# EAGLE design Music (EAGLE 5.04)
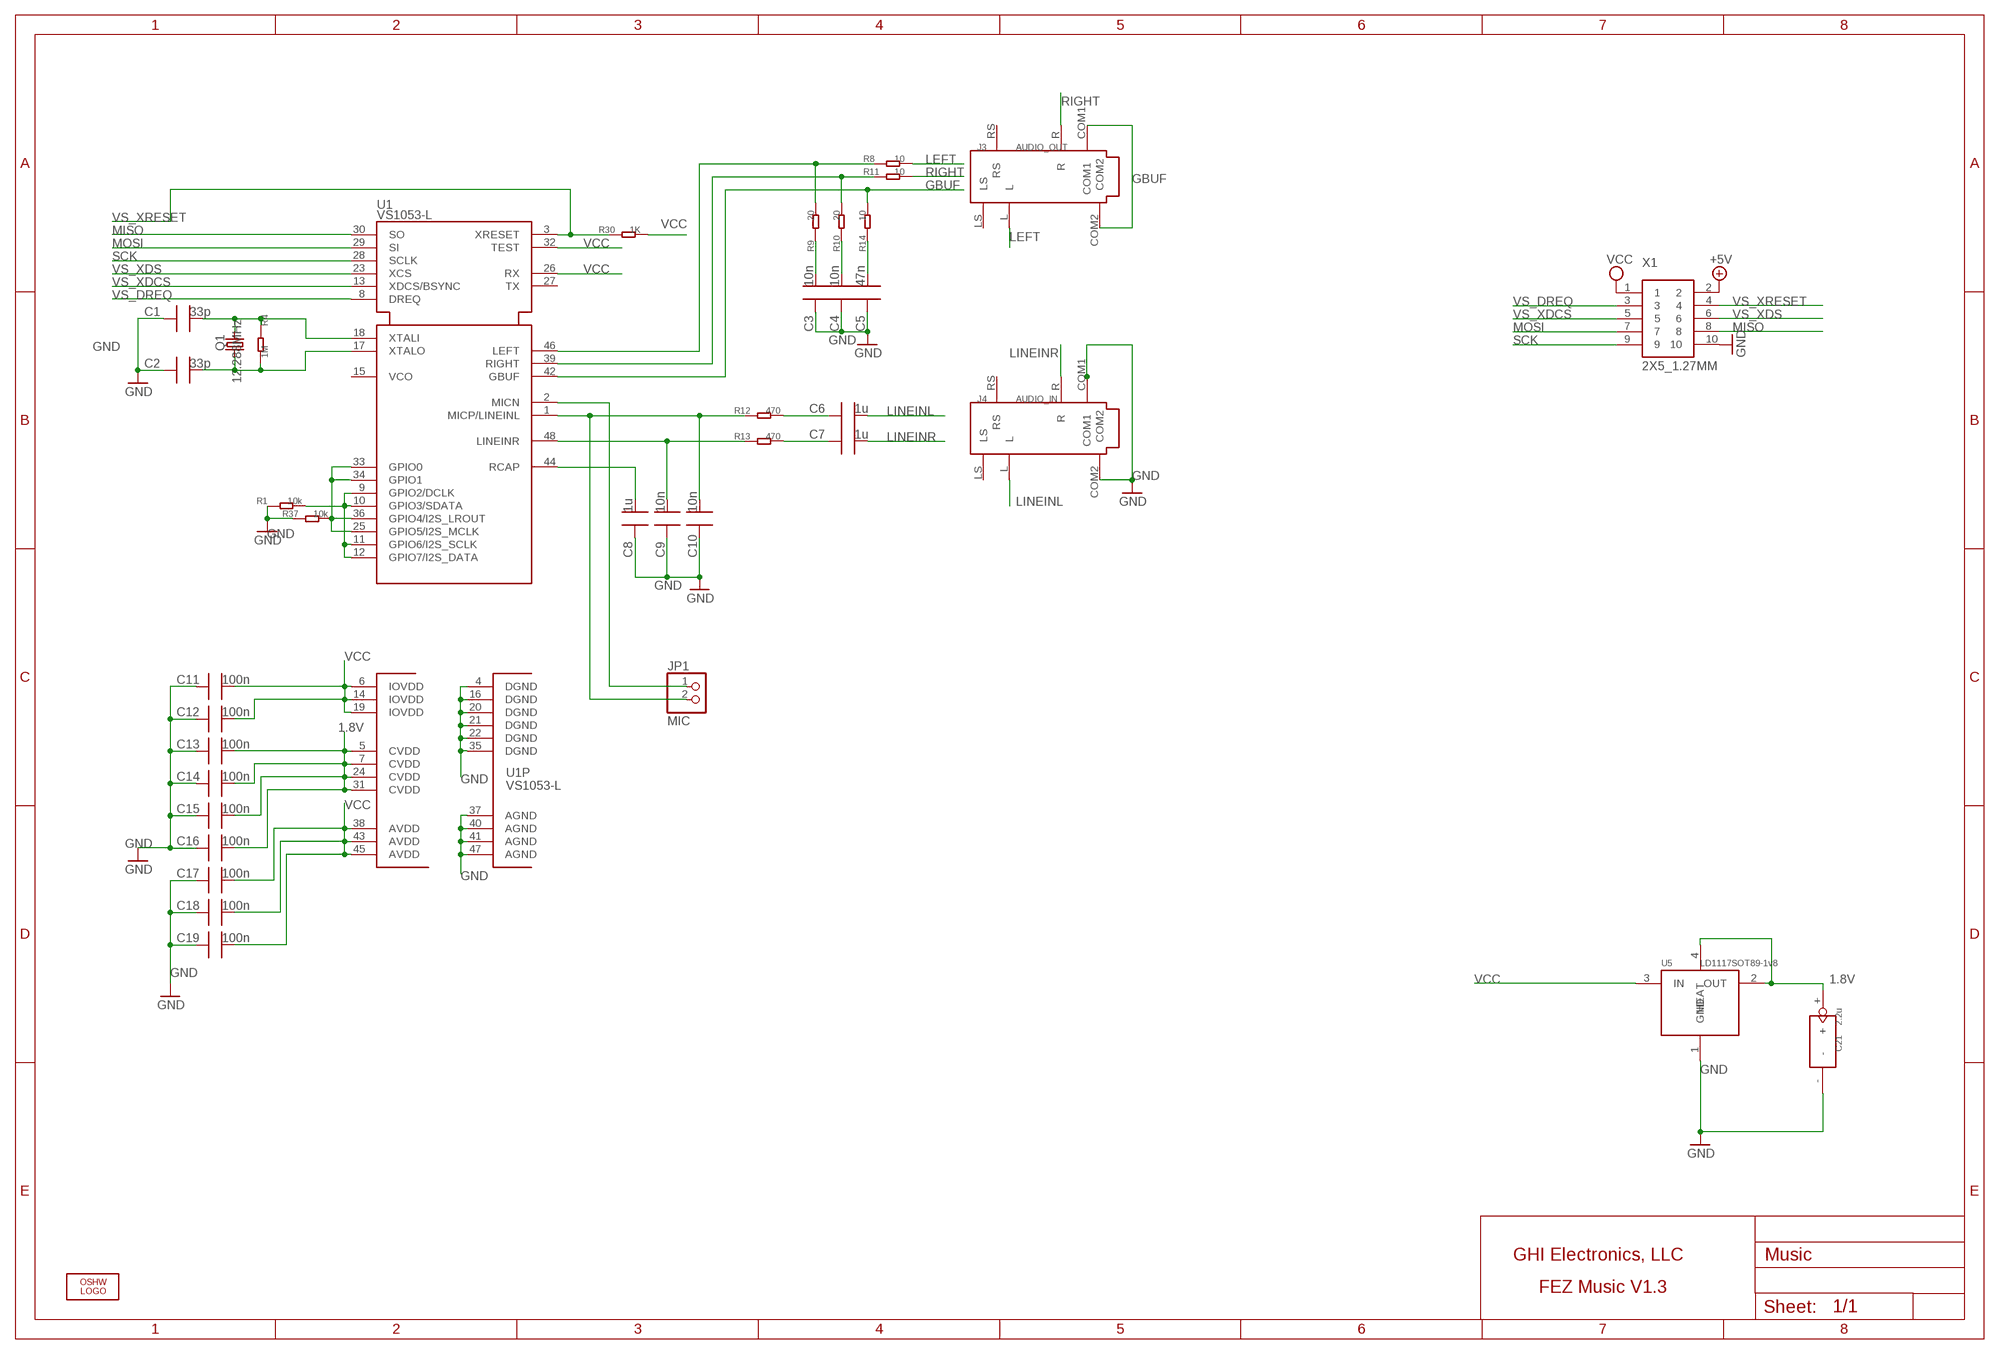
[diagram p0: schematic, sheet 1]

## Parts
C1  33p  C0603  [0603]
C2  33p  C0603  [0603]
C3  10n  C0603  [0603]
C4  10n  C0603  [0603]
C5  47n  C0603  [0603]
C6  1u  C0603  [0603]
C7  1u  C0603  [0603]
C8  1u  C0603  [0603]
C9  10n  C0603  [0603]
C10  10n  C0603  [0603]
C11  100n  C0603  [0603]
C12  100n  C0603  [0603]
C13  100n  C0603  [0603]
C14  100n  C0603  [0603]
C15  100n  C0603  [0603]
C16  100n  C0603  [0603]
C17  100n  C0603  [0603]
C18  100n  C0603  [0603]
C19  100n  C0603  [0603]
C21  2.2u  C_TAN_3X3.5  [C_TAN_3X3.5]
J3  AUDIO_OUT  AUDIO  [3.5MM_AUDIO]
J4  AUDIO_IN  AUDIO  [3.5MM_AUDIO]
JP1  MIC  PINHD-1X2  [1X02]
LOGO2  LOGO-OSHW-FILLX0200-NT  [OSHW_FILLX200_NOTEXT]
Q1  12.288MHz  CRYSTALHC49UP  [HC49UP]
R1  10k  R0603  [0603]
R4  1M  R0603  [0603]
R8  10  R0603  [0603]
R9  20  R0603  [0603]
R10  20  R0603  [0603]
R11  10  R0603  [0603]
R12  470  R0603  [0603]
R13  470  R0603  [0603]
R14  10  R0603  [0603]
R30  1K  R0603  [0603]
R37  10k  R0603  [0603]
U1  VS1053-L  [LQFP48]
U5  LD1117SOT89-1v8  LD1117SOT89  [SOT89]
X1  2X5_1.27MM  [2X5_1.27MM]

## Nets
1.8V: C13.2 C14.2 C15.2 C16.2 C21.+ U1.5(CVDD) U1.7(CVDD) U1.24(CVDD) U1.31(CVDD) U5.2(OUT) U5.4(HEAT)
+5V: X1.2
GBUF: J3.COM1 J3.COM2 R14.2 U1.42(GBUF)
GND: C1.1 C2.1 C3.1 C4.1 C5.1 C8.1 C9.1 C10.1 C11.1 C12.1 C13.1 C14.1 C15.1 C16.1 C17.1 C18.1 C19.1 C21.- J4.COM1 J4.COM2 R1.1 R37.1 U1.4(DGND) U1.16(DGND) U1.20(DGND) U1.21(DGND) U1.22(DGND) U1.35(DGND) U1.37(AGND) U1.40(AGND) U1.41(AGND) U1.47(AGND) U5.1(GND) X1.10
LEFT: J3.L R8.2
LINEINL: C6.2 J4.L
LINEINR: C7.2 J4.R
MISO: U1.30(SO) X1.8
MOSI: U1.29(SI) X1.7
N$1: C1.2 Q1.2 R4.1 U1.18(XTALI)
N$2: C2.2 Q1.1 R4.2 U1.17(XTALO)
N$5: R8.1 R9.2 U1.46(LEFT)
N$6: R10.2 R11.1 U1.39(RIGHT)
N$7: C10.2 JP1.2 R12.1 U1.1(MICP/LINEINL)
N$8: C3.2 R9.1
N$9: C4.2 R10.1
N$10: C5.2 R14.1
N$11: C9.2 R13.1 U1.48(LINEINR)
N$12: C8.2 U1.44(RCAP)
N$14: C6.1 R12.2
N$15: C7.1 R13.2
N$21: R37.2 U1.25(GPIO5/I2S_MCLK) U1.33(GPIO0) U1.34(GPIO1) U1.36(GPIO4/I2S_LROUT)
N$24: R1.2 U1.9(GPIO2/DCLK) U1.10(GPIO3/SDATA) U1.11(GPIO6/I2S_SCLK) U1.12(GPIO7/I2S_DATA)
N$25: JP1.1 U1.2(MICN)
RIGHT: J3.R R11.2
SCK: U1.28(SCLK) X1.9
VCC [power]: C11.2 C12.2 C17.2 C18.2 C19.2 R30.2 U1.6(IOVDD) U1.14(IOVDD) U1.19(IOVDD) U1.26(RX) U1.32(TEST) U1.38(AVDD) U1.43(AVDD) U1.45(AVDD) U5.3(IN) X1.1
VS_DREQ: U1.8(DREQ) X1.3
VS_XDCS: U1.13(XDCS/BSYNC) X1.5
VS_XDS: U1.23(XCS) X1.6
VS_XRESET: R30.1 U1.3(XRESET) X1.4
Unconnected: J3.LS J3.RS J4.LS J4.RS U1.15(VCO) U1.27(TX)

## Notes on the sheet
- GHI Electronics, LLC
- FEZ Music V1.3

## Library data of the parts
C1-C19 = CPT_SMD:C0603; C0603: 100N
C21 = CPT_SMD:C_TAN
J3 J4 = MusicShield:AUDIO
JP1 = pinhead:PINHD-1X2: PIN HEADER
LOGO2 = Logo:LOGO-OSHW-FILL
Q1 = crystal:CRYSTAL: CRYSTAL
R1 R4 R8-R14 R30 R37 = CPT_SMD:R0603
U1 = vlsi:VS1053
U5 = ICs_v54:LD1117
X1 = GHI:2X5_1.27MM

## Net classes
0 default: width 0.152 mm, drill 0.305 mm, clearance 0.152 mm

## Board
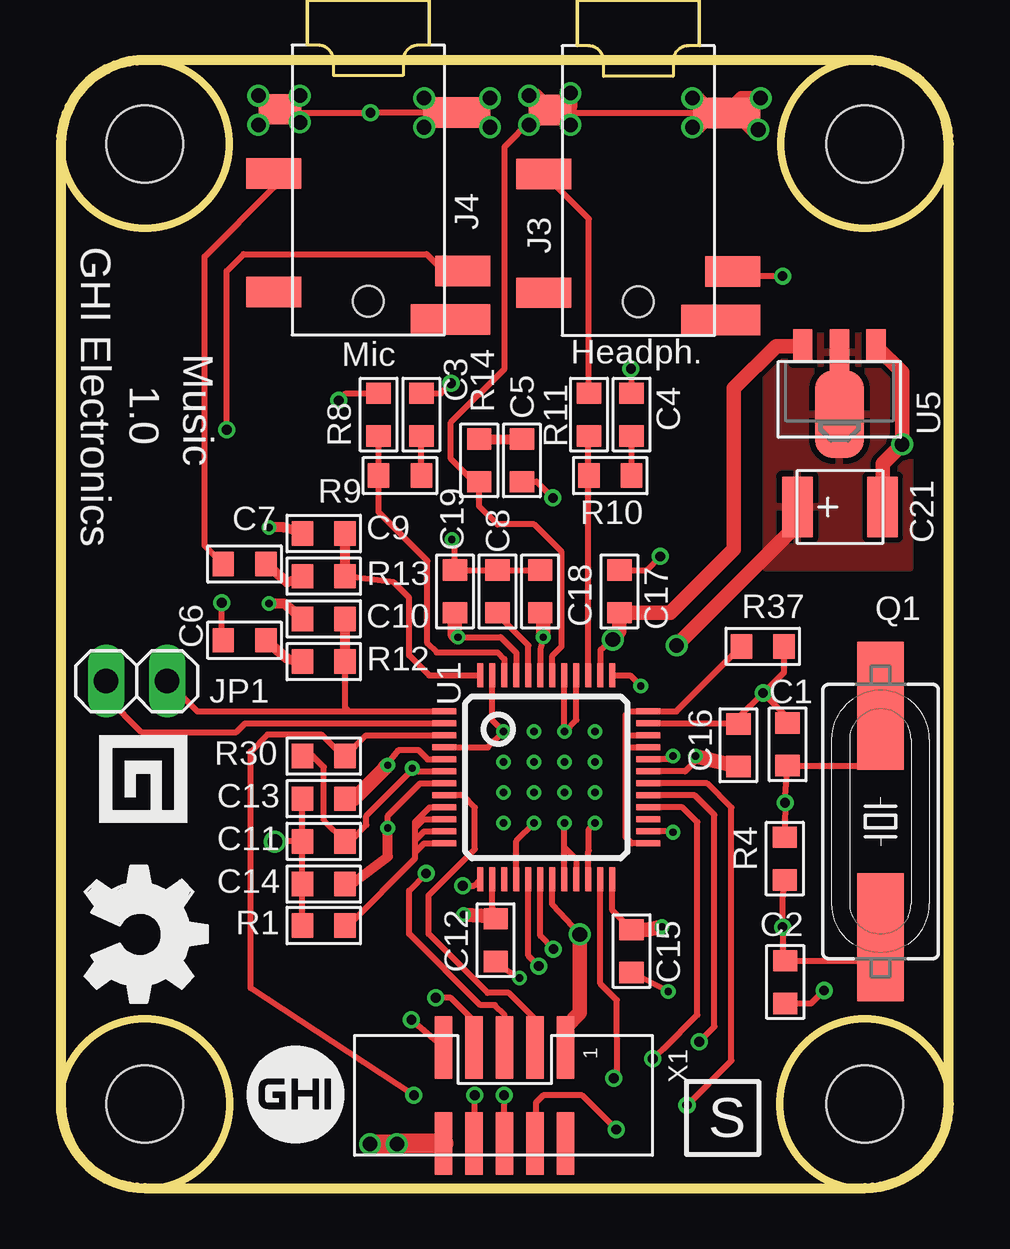
[diagram p1: board, top side]
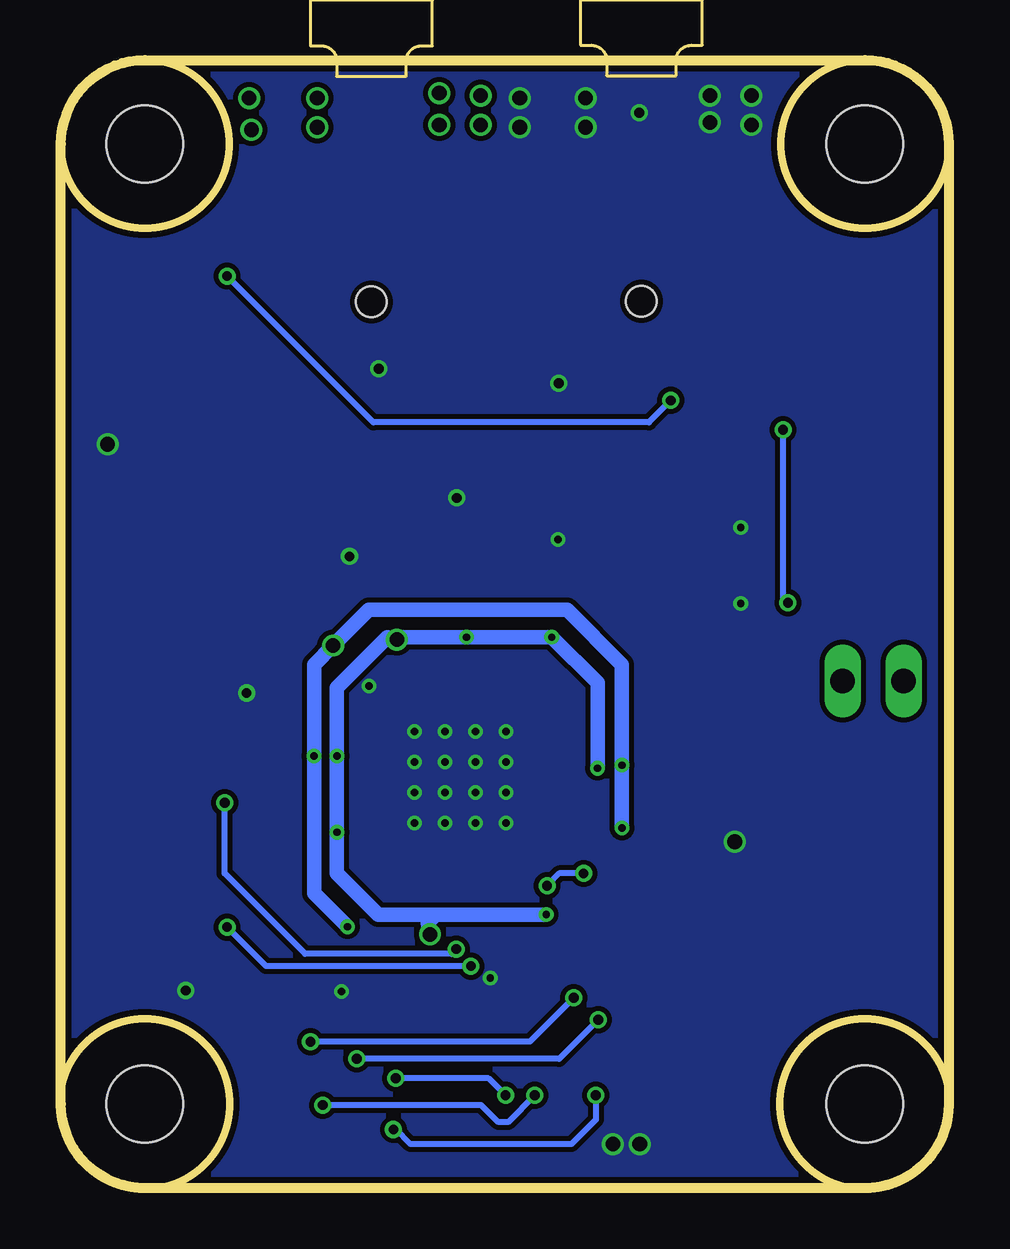
[diagram p2: board, bottom side, seen from below]

Size 37.07 x 47.04 mm. Coordinates in mm from the lower left corner, seen from the top.
Outline: 33.54,0.04 arc90 37.04,3.54 37.04,43.54 arc90 33.54,47.04 3.54,47.04 arc90 0.04,43.54 0.04,3.54 arc90 3.54,0.04 33.54,0.04
Outline: circle at 3.54,43.54 radius 3.5
Outline: circle at 33.54,43.54 radius 3.5
Outline: circle at 33.54,3.54 radius 3.54
Outline: circle at 3.54,3.54 radius 3.54
Copper layers (1+16): Top 0.035mm / dielectric 1.5mm / Bottom 0.035mm
Design rules "SeeedStudio_rule_no_angle_090911 *": minimum track width 6mil, minimum drill 12mil, track to track 8mil, track to pad 8mil, pad to pad 8mil, via to via 8mil, smd to smd 8mil, copper to edge 10mil, drill to drill 10mil, minimum pad ring 10mil, minimum via ring 6mil, stop-mask expansion 2mil, vias tented up to drill 100mil, thermal gap 10mil
Holes 3.2 mm at 3.54,3.54 33.54,43.54 3.54,43.54 33.54,3.54

### Footprints (pad centres in the part's own frame; a part is rotated, then mirrored left to right if it is on the bottom)
0603 = smd 0.889 x 1.016: 1 -0.889,0; 2 0.889,0
C_TAN_3X3.5 = smd 2.54 x 1.27: + 0,1.778; - 0,-1.778
3.5MM_AUDIO = smd 1.27 x 1.778: COM1 -4.572,3.683 | smd 1.27 x 2.794: COM2 -4.699,-3.683 | smd 1.27 x 2.286: L -11.303,-3.937; R -7.239,3.937; RS -12.192,3.937 | smd 1.27 x 3.302: LS -13.335,-3.429 | hole 1.27: -12.573,0
1X02 = drill 1.016 long: 1 -1.27,0; 2 1.27,0
HC49UP = smd 5.334 x 1.93: 1 -4.826,0; 2 4.826,0
LQFP48 = smd 0.25 x 1: 1 -2.75,-4.25; 2 -2.25,-4.25; 3 -1.75,-4.25; 4 -1.25,-4.25; 5 -0.75,-4.25; 6 -0.25,-4.25; 7 0.25,-4.25; 8 0.75,-4.25; 9 1.25,-4.25; 10 1.75,-4.25; 11 2.25,-4.25; 12 2.75,-4.25; 25 2.75,4.25; 26 2.25,4.25; 27 1.75,4.25; 28 1.25,4.25; 29 0.75,4.25; 30 0.25,4.25; 31 -0.25,4.25; 32 -0.75,4.25; 33 -1.25,4.25; 34 -1.75,4.25; 35 -2.25,4.25; 36 -2.75,4.25 | smd 1 x 0.25: 13 4.25,-2.75; 14 4.25,-2.25; 15 4.25,-1.75; 16 4.25,-1.25; 17 4.25,-0.75; 18 4.25,-0.25; 19 4.25,0.25; 20 4.25,0.75; 21 4.25,1.25; 22 4.25,1.75; 23 4.25,2.25; 24 4.25,2.75; 37 -4.25,2.75; 38 -4.25,2.25; 39 -4.25,1.75; 40 -4.25,1.25; 41 -4.25,0.75; 42 -4.25,0.25; 43 -4.25,-0.25; 44 -4.25,-0.75; 45 -4.25,-1.25; 46 -4.25,-1.75; 47 -4.25,-2.25; 48 -4.25,-2.75
SOT89 = smd 0.8 x 1.4: 1 -1.524,-1.905; 3 1.524,-1.905 | smd 0.8 x 1.9: 2 0,-1.651 | smd 2.032 x 3.65: 4 0,0.94
2X5_1.27MM = smd 2.6 x 0.74: 1 -2,2.58; 2 2,2.58; 3 -2,1.31; 4 2,1.31; 5 -2,0.04; 6 2,0.04; 7 -2,-1.23; 8 2,-1.23; 9 -2,-2.5; 10 2,-2.5

### Placement (x,y rotation side)
C1  30.32,18.52 270 top
C2  30.22,8.62 90 top
C3  15.06,32.26 270 top
C4  23.82,32.26 270 top
C5  19.25,30.35 90 top
C6  7.69,22.86 180 top
C7  7.69,26.03 180 top
C8  18.23,24.89 270 top
C9  10.99,27.3 0 top
C10  10.99,23.75 0 top
C11  10.99,14.48 0 top
C12  18.15,10.36 90 top
C13  10.99,16.26 0 top
C14  10.99,12.7 0 top
C15  23.82,9.91 90 top
C16  28.27,18.48 270 top
C17  23.31,24.89 270 top
C18  20.01,24.89 270 top
C19  16.45,24.89 270 top
C21  32.5,28.41 90 top
J3  24.1,49.53 90 top
J4  12.85,49.56 90 top
JP1  3.19,21.16 0 top
LOGO2  1.05,13.45 270 top
Q1  34.19,15.31 90 top
R1  10.99,10.97 0 top
R4  30.2,13.76 270 top
R8  13.28,32.26 90 top
R9  14.17,29.72 180 top
R10  22.93,29.72 180 top
R11  22.04,32.26 90 top
R12  10.99,21.97 180 top
R13  10.99,25.53 180 top
R14  17.47,30.35 270 top
R30  10.99,18.03 180 top
R37  29.28,22.61 180 top
U1  20.26,17.14 270 top
U5  32.48,33.21 180 top
X1  18.48,3.9 270 top

### Tracks (layer width: path | path; a pad name or v marks a point on that pad's centre or on a via)
1.8V  (via drill 0.3, 0.61)
  Top 0.254: v26.48,18.03 26.49,17.83 26.05,17.39 U1.31 | U1.5 15.32,17.89 14.93,18.29 14.12,18.29 13.53,17.58 | U1.7 15.94,16.89 15.06,16.89 15,16.89 13.66,15.54 v13.66,15.04 13.66,14.99 | U1.24 23.01,11.6 C15.2
  Top 0.406: 13.66,14.99 13.66,13.84 12.13,12.7 C14.2
  Top 0.61: C15.2 24.45,10.79 v25.09,10.92 | C16.2 v26.49,18.03 v26.48,18.03 | C13.2 12.26,16.26 v13.66,17.65 13.61,17.65 13.53,17.58 | C21.+ 30.72,27.67 v25.69,22.64
  Bottom 0.61: v25.09,10.92 26.49,12.32 v26.49,18.03 26.49,21.84 v25.69,22.64 24.2,24.13 15.94,24.13 13.66,21.84 v13.66,17.65 v13.66,15.04
  pour Top: 35.4,25.87 29.43,25.87 29.43,35.52 35.4,35.52
GBUF  (via drill 0.61)
  Top 0.254: U1.42 20.51,22.22 20.9,22.61 20.9,26.54 19.75,27.69 18.23,27.69 17.47,28.45 R14.2 17.24,29.46 16.29,30.41 16.29,31.94 18.53,34.17 18.53,43.42 19.64,44.54 20.4,44.94 J3.COM1 20.54,44.83 20.97,44.83 21.27,44.83 27.16,44.83 J3.COM2
  Top 0.61: v19.54,45.55 19.82,45.55 J3.COM1 | v21.27,45.65 21.27,45.14 20.97,44.83 20.47,44.83 20.36,44.94 20.15,44.94 v19.54,44.33 | 21.27,44.83 v21.27,44.33 | v26.35,45.45 26.54,45.45 27.16,44.83 26.56,44.23 v26.35,44.23 | v29.19,45.45 28.4,45.45 J3.COM2 27.97,44.64 28.38,44.64 28.89,44.13 v29.09,44.13
GND  (via drill 0.3, 0.41, 0.61)
  Top 0.254: U1.47 18.01,19.52 v18.48,19.05 17.83,18.39 U1.4 | 21.01,14.22 21.01,15.23 v21.02,15.24 | U1.20 21.01,14.22 | U1.21 21.51,13.72 21.01,14.22 | U1.22 22.01,14.07 22.04,14.1 22.04,14.99 v22.29,15.24 | U1.16 19.01,14.5 v19.75,15.24 | U1.41 21.01,19.06 v21.02,19.05 21.51,19.54 U1.40 | R1.1 C14.1 C11.1 | C12.1 18.36,9.27 v19.15,8.79 | C15.1 v25.34,8.23 | C11.1 8.97,14.48 v8.95,14.46 | C11.1 C13.1 | v16.33,27.05 16.45,26.92 C19.1 C8.1 C18.1 | C17.1 24.44,25.78 v25.01,26.35 | C5.1 19.86,29.46 v20.54,28.79 | C4.1 23.82,34.14 v23.79,34.17 | C2.1 31.3,7.73 v31.84,8.27 | U1.37 23.76,21.39 v24.2,20.95 | U1.35 28.24,19.39 C16.1 28.27,19.63 v29.3,20.66 | R37.1 30.17,21.53 v29.3,20.66 | C1.1 30.32,19.64 v29.3,20.66 | C3.1 15.87,33.15 v16.29,33.56 | J4.COM2 12.95,44.86 v12.94,44.84 9.31,44.84 J4.COM1
  Top 0.406: v8.71,27.56 9.34,27.56 C9.1 | v8.71,24.38 9.34,24.38 C10.1
  Top 0.61: C21.- 34.28,30.21 v35.09,31.02 35.09,34.03 U5.1
  Top 0.813: X1.10 14.07,1.9 v14.03,1.86 v12.92,1.86
  other vias: 22.29,19.05 22.29,17.78 22.29,16.51 18.48,15.24 18.48,16.51 18.48,17.78 19.75,19.05 21.02,17.78 21.02,16.51 19.75,16.51 19.75,17.78 8.27,45.55 8.27,44.33 9.99,44.43 9.99,45.55 15.17,45.45 15.17,44.23 17.92,44.23 17.92,45.45
  pour Bottom: 0.34,-0.07 33.7,-0.07 arc90 37.2,3.43 37.2,46.97 3.84,46.97 arc90 0.34,43.47
LEFT  (via drill 0.41)
  Top 0.254: R8.2 11.91,33.15 v11.62,32.85 | v30.11,38.03 28.23,38.03 J3.L
  Bottom 0.254: v11.62,32.85 12.53,31.94 24.01,31.94 v30.11,38.03
LINEINL  (via drill 0.41)
  Top 0.254: J4.L 15.97,38.25 15.28,38.95 7.66,38.95 6.94,38.24 v6.94,31.63 | v6.74,24.42 6.74,22.92 C6.2
  Bottom 0.254: v6.94,31.63 6.94,24.62 v6.74,24.42
LINEINR
  Top 0.254: J4.R 8.91,41.73 6.03,38.85 6.03,26.81 C7.2
MISO  (via drill 0.41)
  Top 0.254: 26.25,3.59 v26.13,3.49 27.98,5.34 27.98,15.89 26.97,16.89 U1.30 | v17.29,3.9 17.29,1.93 X1.8
  Bottom 0.254: v26.13,3.49 19.52,3.49 18.81,2.78 18.4,2.78 v17.29,3.9
MOSI  (via drill 0.41)
  Top 0.254: 26.65,6.13 v26.63,6.13 27.26,6.76 27.26,15.58 26.45,16.39 U1.29 | v15.66,7.96 16.29,7.96 17.29,6.97 17.29,5.93 X1.7
  Bottom 0.254: v26.63,6.13 17.49,6.13 v15.66,7.96
N$1  (via drill 0.41)
  Top 0.254: U1.18 20.01,10.54 v20.56,9.99 | R4.1 30.2,15.06 v30.21,16.09 30.21,16.41 C1.2 33.79,17.63 34.07,19.24 34.07,20.01 Q1.2
  Bottom 0.254: v20.56,9.99 20.76,9.79 26.86,9.79 30.21,13.14 v30.21,16.09
N$2  (via drill 0.41)
  Top 0.254: U1.17 19.51,9.72 v19.95,9.28 | R4.2 30.11,12.07 v30.11,10.91 30.11,9.61 C2.2 33.22,9.5 Q1.1
  Bottom 0.254: v19.95,9.28 28.48,9.28 v30.11,10.91
N$5
  Top 0.254: U1.46 18.51,22.07 18.23,22.35 15.69,22.35 15.31,22.73 15.31,26.16 13.28,28.19 R9.2 R8.1
N$6
  Top 0.254: U1.39 22.01,29.75 | 22.01,29.75 R10.2 | 22.01,29.75 22.01,31.09 R11.1
N$7
  Top 0.254: 12.02,19.89 5.72,19.89 JP1.2 | 12.02,19.89 U1.1 | R12.1 11.88,20.04 12.02,19.89
  Top 0.406: R12.1 C10.2
N$8
  Top 0.254: R9.1 C3.2
N$9
  Top 0.254: R10.1 C4.2
N$10
  Top 0.406: R14.1 C5.2
N$11
  Top 0.254: U1.48 15.38,21.39 14.55,22.22 14.55,24.64 13.91,25.27 R13.1
  Top 0.406: R13.1 C9.2
N$12
  Top 0.254: C8.2 18.23,23.93 19.51,22.64 U1.44
N$14
  Top 0.406: R12.2 9.47,22.1 C6.1
N$15
  Top 0.406: R13.2 9.47,25.27 C7.1
N$21
  Top 0.254: U1.25 23.83,14.39 23.56,14.66 23.56,18.34 | 23.56,18.85 23.56,19.74 23.72,19.89 U1.36 25.68,19.89 R37.2 | 23.56,18.34 23.56,18.85 | U1.34 23.61,18.89 23.56,18.85 | U1.33 23.62,18.39 23.56,18.34
N$24
  Top 0.254: U1.9 15.41,15.89 14.8,15.29 14.8,15.04 | 14.8,14.02 14.8,13.77 12.01,10.97 R1.2 | 14.8,14.02 14.8,14.53 | 14.8,14.53 14.8,15.04 | U1.12 15.18,14.39 14.8,14.02 | U1.11 15.17,14.89 14.8,14.53 | U1.10 15.16,15.39 14.8,15.04
N$25
  Top 0.254: U1.2 7.71,19.39 7.35,19.03 3.39,19.03 1.97,20.46 1.97,21.11 JP1.1
RIGHT
  Top 0.254: R11.2 22.04,40.41 J3.R
SCK  (via drill 0.41)
  Top 0.254: v24.7,5.42 25.13,5.83 26.55,7.25 26.55,15.28 25.93,15.89 U1.28 | v14.64,7.05 15.97,5.91 X1.9
  Bottom 0.254: v24.7,5.42 16.27,5.42 v14.64,7.05
VCC  (via drill 0.3, 0.61)
  Top 0.254: U1.26 25.5,14.89 v25.54,14.86 | U1.38 22.51,22.44 v23.03,22.89 | U1.43 20.01,22.48 v20.14,22.99 | U1.32 25.4,17.89 v25.54,18.03 | U1.45 19.01,22.33 18.36,22.99 v16.58,22.99 | U1.14 18.01,11.72 C12.2 | U1.6 14.93,17.39 v14.67,17.53 14.62,17.53 14.62,17.4 12.77,15.54 12.77,15.16 12.13,14.53 11.88,14.78 C11.2 10.99,15.37 10.99,17.58 10.53,18.03 R30.2 | U1.19 20.51,11.85 v21.65,10.6
  Top 0.61: C19.2 16.45,23.11 v16.58,22.99 | v20.14,22.99 20.14,23.93 20.01,24.05 C18.2 | v23.03,22.89 23.31,23.24 C17.2 25.44,24.01 28.08,26.65 28.08,33.36 29.83,35.12 U5.3 | C12.2 17.98,11.35 v16.81,11.43 | X1.1 21.01,6.71 21.05,6.74 21.07,6.74 21.65,7.33 v21.65,10.6
  Bottom 0.61: 21.41,11.43 v16.81,11.43 | 21.41,11.43 23.82,11.43 25.54,13.15 v25.54,14.86 v25.54,18.03 25.54,20.89 23.44,22.99 v23.03,22.89 23.1,22.9 23.01,22.99 v20.14,22.99 v16.58,22.99 14.67,21.08 v14.67,17.53 | v21.65,10.6 21.76,11.08 21.41,11.43
VS_DREQ
  Top 0.254: U1.8 16.78,16.39 17.29,15.89 17.29,14.16 15.36,12.23 15.36,10.62 17.82,8.16 18.71,8.16 19.72,7.15 19.72,5.96 X1.3
VS_XDCS  (via drill 0.41)
  Top 0.254: v15.25,13.14 14.54,12.43 14.54,10.62 17.51,7.66 18.12,7.66 18.53,7.25 X1.5 | v16.78,12.63 17.25,12.63 U1.13
  Bottom 0.254: v15.25,13.14 16.27,13.14 v16.78,12.63
VS_XDS  (via drill 0.41)
  Top 0.254: U1.23 22.51,8.55 23.2,7.86 23.22,4.75 v23.08,4.61 | v18.51,3.9 18.51,1.91 X1.6
  Bottom 0.254: v23.08,4.61 19.22,4.61 v18.51,3.9
VS_XRESET  (via drill 0.41)
  Top 0.254: R30.1 12.13,18.03 11.63,17.7 11.63,18.19 10.89,18.93 8.65,18.93 7.94,18.22 7.94,8.37 v14.75,3.9 | R30.1 11.88,18.29 | X1.4 19.83,1.93 19.83,3.59 20.13,3.9 21.76,3.9 v23.18,2.47 | U1.3 12.74,18.89 R30.1
  Bottom 0.254: v14.75,3.9 14.75,2.88 15.76,1.86 22.47,1.86 23.08,2.47 v23.18,2.47

### Text on the board
tPlace: GHI Electronics | Music | Mic | Headph. | 1.0 | S | corner holes are nonplated | black PCB with white text | do not add manufacturing codes
bPlace: no text on back